# EAGLE design FlowSensor2 (EAGLE 9.5.0)
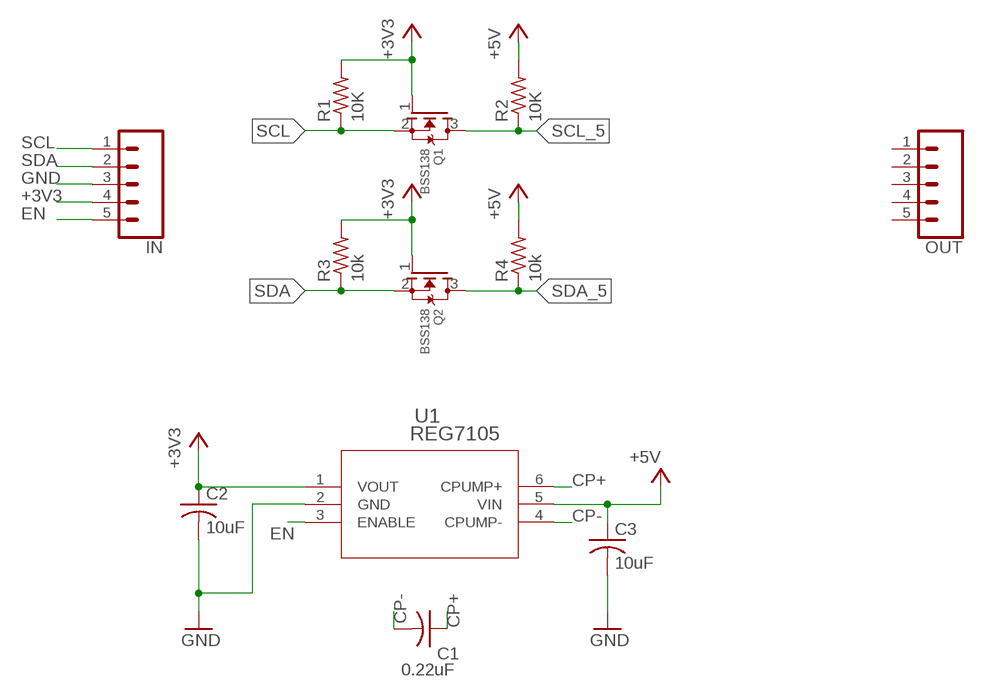
[diagram p0: schematic, sheet 1]

## Parts
C1  0.22uF  C-USC0805K  [C0805K]
C2  10uF  C-USC0805K  [C0805K]
C3  10uF  C-USC0805K  [C0805K]
IN  CONN_05PTH_LONGPADS  [1X05_LONGPADS]
OUT  CONN_05PTH_LONGPADS  [1X05_LONGPADS]
Q1  BSS138  MOSFET-NREFLOW  [SOT23]
Q2  BSS138  MOSFET-NREFLOW  [SOT23]
R1  10K  R-US_R1206  [R1206]
R2  10K  R-US_R1206  [R1206]
R3  10k  R-US_R1206  [R1206]
R4  10k  R-US_R1206  [R1206]
U1  REG7105  REG71050DDCRDDC6-M  [DDC6-M]

## Nets
+3V3: C2.1 IN.4 Q1.1(G) Q2.1(G) R1.2 R3.2 U1.1(VOUT)
+5V: C3.1 R2.2 R4.2 U1.5(VIN)
CP+: C1.1 U1.6(CPUMP+)
CP-: C1.2 U1.4(CPUMP-)
EN: IN.5 U1.3(ENABLE)
GND: C2.2 C3.2 IN.3 U1.2(GND)
SCL: IN.1 Q1.2(S) R1.1
SCL_5: Q1.3(D) R2.1
SDA: IN.2 Q2.2(S) R3.1
SDA_5: Q2.3(D) R4.1
Unconnected: OUT.1 OUT.2 OUT.3 OUT.4 OUT.5

## Library data of the parts
C1-C3 = adafruit:C-US: CAPACITOR, American symbol
IN OUT = SparkFun-Connectors:CONN_05: Multi connection point. Often used as Generic Header-pin footprint for 0.1 inch spaced/style header connections On any of the 0.1 inch spaced packages, you can populate with these: Break Away Headers - Straight <https://www.sparkfun.com/products/116> (PRT-00116) Break Away Male Headers - Right Angle <https://www.sparkfun.com/products/553> (PRT-00553) Female Headers <https://www.sparkfun.com/products/115> (PRT-00115) Break Away Headers - Machine Pin <https://www.sparkfun.com/products/117> (PRT-00117) Break Away Female Headers - Swiss Machine Pin <https://www.sparkfun.com/products/743> (PRT-00743) For SCREWTERMINALS and SPRING TERMINALS visit here: Screw Terimnals on SparkFun.com <https://www.sparkfun.com/search/results?term=Screw+Terminals> (5mm/3.5mm/2.54mm spacing) This device is also useful as a general connection point to wire up your design to another part of your project. Our various solder wires solder well into these plated through hole pads. Hook-Up Wire - Assortment (Stranded, 22 AWG) <https://www.sparkfun.com/products/11375> (PRT-11375) Hook-Up Wire - Assortment (Solid Core, 22 AWG) <https://www.sparkfun.com/products/11367> (PRT-11367) View the entire wire category on our website here <https://www.sparkfun.com/categories/141> Special notes: Molex polarized connector foot print use with SKU : PRT-08231 with associated crimp pins and housings. 1MM SMD Version SKU: PRT-10208
Q1 Q2 = adafruit:MOSFET-N: N-Channel Mosfet 2N7002E - 60V 260mA SOT23 [Digikey: 2N7002ET1GOSTR-ND] - REEL BSH103 - 30V 850mA SOT23 [Digikey: 568-5013-1-ND]
R1-R4 = adafruit:R-US_: RESISTOR, American symbol
U1 = REG7105:REG71050DDCR; DATASHEET_URL: http://www.ti.com/lit/gpn/REG71050; DESCRIPTION: 60-mA, 5.0-V, Buck/Boost Charge Pump in ThinSOT-23; FAMILY_NAME: BUCK-BOOST CHARGE PUMP REGULATOR; GENERIC_PART_NUMBER: REG71050; INDUSTRY_STD_PKG_TYPE: SOT; MANUFACTURER: Texas Instruments; MANUFACTURER_PART_NUMBER: REG71050DDCR; PACKAGE_DESIGNATOR: DDC; PIN_COUNT: 6; VENDOR: Texas Instruments

## Board
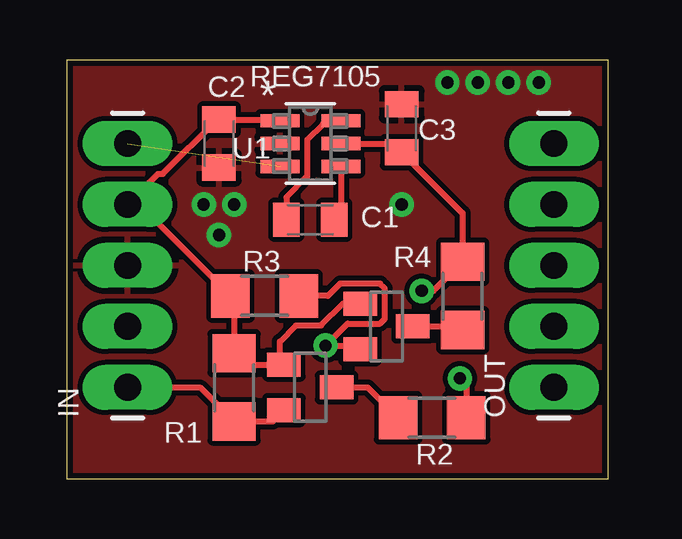
[diagram p1: board, top side]
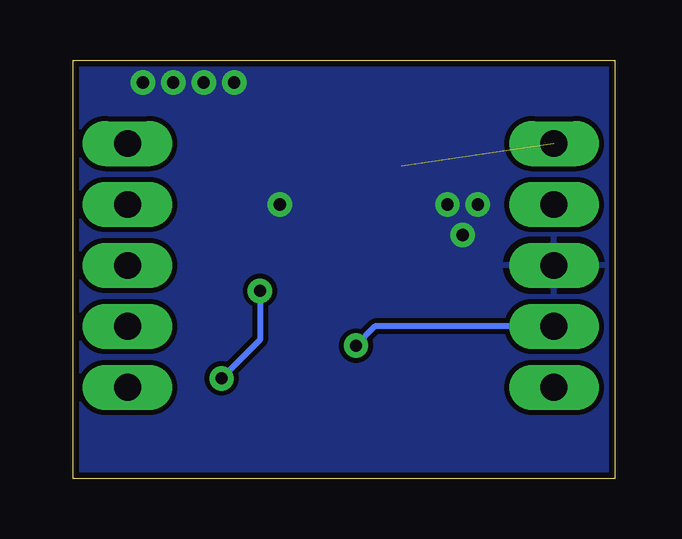
[diagram p2: board, bottom side, seen from below]

Size 22.59 x 17.45 mm. Coordinates in mm from the lower left corner, seen from the top.
Outline: 0,0 22.59,0 22.59,17.45 0,17.45 0,0
Copper layers (1*16): Top 0.035mm / dielectric 1.5mm / Bottom 0.035mm
Design rules "SparkFun": minimum track width 8mil, minimum drill 20mil, track to track 8mil, track to pad 8mil, pad to pad 8mil, via to via 8mil, smd to smd 8mil, copper to edge 10mil, drill to drill 8mil, minimum pad ring 12mil, minimum via ring 10mil, stop-mask expansion 4mil, vias tented up to drill 25mil, thermal gap 10mil

### Footprints (pad centres in the part's own frame; a part is rotated, then mirrored left to right if it is on the bottom)
C0805K = smd 1.1 x 1.4: 1 -1,0; 2 1,0
1X05_LONGPADS = drill 1.118 pad 1.88 long: 1 0,0; 2 2.54,0; 3 5.08,0; 4 7.62,0; 5 10.16,0
SOT23 = smd 1 x 1.4: 1 -0.95,-1.1; 2 0.95,-1.1; 3 0,1.1
R1206 = smd 1.6 x 1.803: 1 -1.422,0; 2 1.422,0
DDC6-M = smd 1.626 x 0.559: 1 -1.27,0.95; 2 -1.27,0; 3 -1.27,-0.95; 4 1.27,-0.95; 5 1.27,0; 6 1.27,0.95

### Placement (x,y rotation side)
C1  10.16,10.79 0 top
C2  6.35,13.97 270 top
C3  13.97,14.61 90 top
IN  2.54,3.81 90 top
OUT  20.32,3.81 90 top
Q1  10.16,3.81 270 top
Q2  13.34,6.35 270 top
R1  6.99,3.81 90 top
R2  15.24,2.54 0 top
R3  8.26,7.62 180 top
R4  16.51,7.62 90 top
U1  10.16,13.97 0 top

### Tracks (layer width: path | path; a pad name or v marks a point on that pad's centre or on a via)
+3V3
  Top 0.254: Q2.1 11.53,7.3 10.61,6.39 9.56,6.39 8.89,5.71 8.89,4.93 Q1.1 7.46,4.76 R1.2 6.99,7.47 R3.2 3.02,11.43 IN.4 3.81,12.7 4.01,12.7 6.28,14.97 C2.1 8.84,14.97 U1.1
+5V  (via drill 0.51)
  Top 0.254: U1.5 13.61,13.97 C3.1 16.51,11.07 R4.2 15.3,7.83 v14.8,7.83 | v16.4,4.19 16.66,3.93 R2.2
  Bottom 0.254: v14.8,7.83 14.8,5.79 v16.4,4.19
CP+
  Top 0.254: U1.6 11.29,14.78 10.68,14.78 10.03,14.13 10.03,12.6 9.16,11.73 C1.1
CP-
  Top 0.254: U1.4 11.43,11.07 C1.2
EN  (1 unrouted)
GND  (via drill 0.51)
  other vias: 5.71,11.43 13.97,11.43 6.99,11.43 6.35,10.16 15.88,16.51 17.14,16.51 18.41,16.51 19.68,16.51
  pour Bottom: 0,17.78 22.86,17.78 22.86,0 0,0
  pour Top: 0,17.14 22.23,17.14 22.23,0 0,0
SCL
  Top 0.254: IN.1 5.56,3.81 R1.1 8.59,2.39 Q1.2
SCL_5
  Top 0.254: Q1.3 12.55,3.81 R2.1
SDA  (via drill 0.51)
  Top 0.254: Q2.2 12.09,5.55 v10.79,5.55 11.71,6.47 13.07,6.47 13.27,6.66 13.27,7.94 13.07,8.13 11.4,8.13 10.89,7.62 R3.1
  Bottom 0.254: v10.79,5.55 9.99,6.35 IN.2
SDA_5
  Top 0.254: Q2.3 16.36,6.35 R4.1